# EAGLE design h-bridge2-smd-002 (EAGLE 7.2.0)
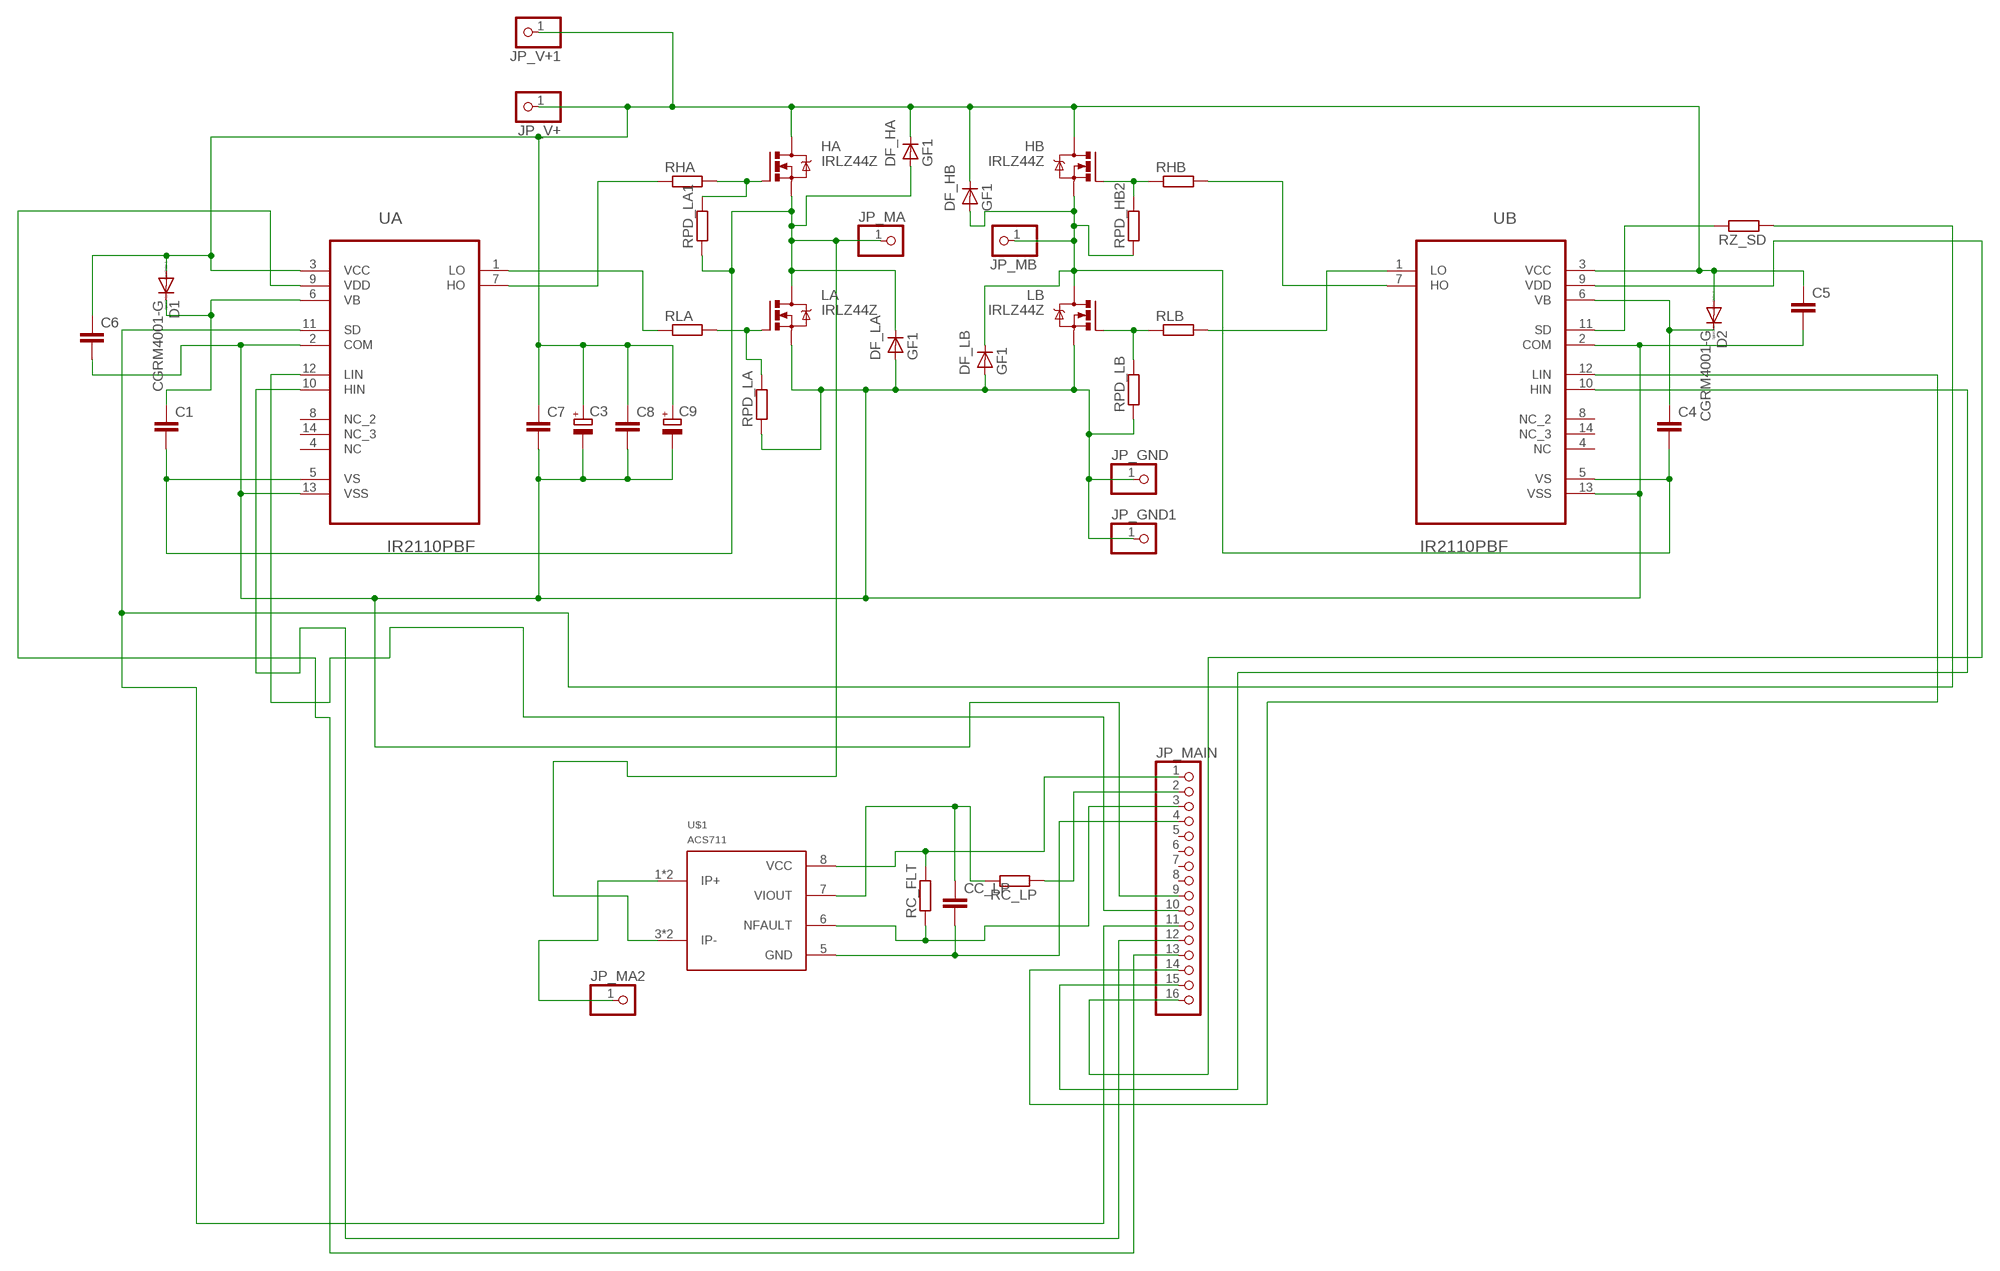
[diagram p0: schematic, sheet 1]

## Parts
C1  C-EUC4532  [C4532]
C3  CPOL-EUE5-13  [E5-13]
C4  C-EUC4532  [C4532]
C5  C-EUC4532  [C4532]
C6  C-EUC4532  [C4532]
C7  C-EUC4532  [C4532]
C8  C-EUC4532  [C4532]
C9  CPOL-EUE5-13  [E5-13]
CC_LP  C-EUC4532  [C4532]
D1  CGRM4001-G  [SOD-123_MINI-SMA]
D2  CGRM4001-G  [SOD-123_MINI-SMA]
DF_HA  GF1  [SMA-DO214AC]
DF_HB  GF1  [SMA-DO214AC]
DF_LA  GF1  [SMA-DO214AC]
DF_LB  GF1  [SMA-DO214AC]
HA  IRLZ44Z  [TO220BH]
HB  IRLZ44Z  [TO220BH]
JP_GND  PINHD-1X1  [1X01]
JP_GND1  PINHD-1X1  [1X01]
JP_MA  PINHD-1X1  [1X01]
JP_MA2  PINHD-1X1  [1X01]
JP_MAIN  PINHD-1X16  [1X16]
JP_MB  PINHD-1X1  [1X01]
JP_V+  PINHD-1X1  [1X01]
JP_V+1  PINHD-1X1  [1X01]
LA  IRLZ44Z  [TO220BH]
LB  IRLZ44Z  [TO220BH]
RC_FLT  R-EU_R1206  [R1206]
RC_LP  R-EU_R1206  [R1206]
RHA  R-EU_R1206  [R1206]
RHB  R-EU_R1206  [R1206]
RLA  R-EU_R1206  [R1206]
RLB  R-EU_R1206  [R1206]
RPD_HB2  R-EU_R1206  [R1206]
RPD_LA  R-EU_R1206  [R1206]
RPD_LA1  R-EU_R1206  [R1206]
RPD_LB  R-EU_R1206  [R1206]
RZ_SD  R-EU_R1206  [R1206]
U$1  ACS711  [SOIC8]
UA  IR2110PBF  [DIP254P762X533-14]
UB  IR2110PBF  [DIP254P762X533-14]

## Nets
N$1: JP_MA2.1 U$1.1(IP+) U$1.2(IP+)
N$2: JP_MAIN.1 RC_FLT.2 U$1.8(VCC)
N$3: JP_MAIN.3 RC_FLT.1 U$1.6(NFAULT)
N$4: C3.- C5.2 C6.2 C7.2 C8.2 C9.- DF_LA.A DF_LB.A JP_GND1.1 JP_GND.1 JP_MAIN.9 LA.S LB.S RPD_LA.1 RPD_LB.1 UA.2(COM) UA.13(VSS) UB.2(COM) UB.13(VSS)
N$5: LA.G RLA.2 RPD_LA.2
N$6: HA.G RHA.2 RPD_LA1.2
N$7: HB.G RHB.1 RPD_HB2.2
N$8: LB.G RLB.1 RPD_LB.2
N$9: RHA.1 UA.7(HO)
N$10: RLA.1 UA.1(LO)
N$11: RHB.2 UB.7(HO)
N$12: RLB.2 UB.1(LO)
N$13: C3.+ C5.1 C6.1 C7.1 C8.1 C9.+ D1.A D2.A DF_HA.K(C) DF_HB.K(C) HA.D HB.D JP_V+1.1 JP_V+.1 UA.3(VCC) UB.3(VCC)
N$14: C1.1 D1.C UA.6(VB)
N$15: CC_LP.1 RC_LP.2 U$1.7(VIOUT)
N$17: C1.2 DF_HA.A DF_LA.K(C) HA.S JP_MA.1 LA.D RPD_LA1.1 U$1.3(IP-) U$1.4(IP-) UA.5(VS)
N$18: C4.1 D2.C UB.6(VB)
N$19: JP_MAIN.2 RC_LP.1
N$20: JP_MAIN.11 RZ_SD.1 UA.11(SD)
N$21: CC_LP.2 JP_MAIN.4 U$1.5(GND)
N$22: JP_MAIN.13 UA.9(VDD)
N$23: JP_MAIN.12 UA.10(HIN)
N$24: JP_MAIN.10 UA.12(LIN)
N$25: JP_MAIN.16 UB.9(VDD)
N$26: JP_MAIN.15 UB.10(HIN)
N$27: JP_MAIN.14 UB.12(LIN)
N$28: RZ_SD.2 UB.11(SD)
N$29: C4.2 DF_HB.A DF_LB.K(C) HB.S JP_MB.1 LB.D RPD_HB2.1 UB.5(VS)
Unconnected: JP_MAIN.5 JP_MAIN.6 JP_MAIN.7 JP_MAIN.8 UA.4(NC) UA.8(NC_2) UA.14(NC_3) UB.4(NC) UB.8(NC_2) UB.14(NC_3)

## Library data of the parts
C1 C4-C8 CC_LP = rcl:C-EU: CAPACITOR, European symbol
C3 C9 = rcl:CPOL-EU: POLARIZED CAPACITOR, European symbol
D1 D2 = diode:CGRM400*-G: Molded plasitc,JEDEC SOD-123/Mini SMA Source: Comchip CGRM4001-G.pdf
DF_HA DF_HB DF_LA DF_LB = diode:GF1: DIODE
HA HB LA LB = transistor-power:IRLZ44Z: N-Channel HEXFET® Power MOSFET Logic Level AUTOMOTIVE MOSFET Source: http://www.irf.com/product-info/datasheets/data/irlz44zpbf.pdf
JP_GND JP_GND1 JP_MA JP_MA2 JP_MB JP_V+ JP_V+1 = dbg-misc:PINHD-1X1: PIN HEADER
JP_MAIN = pinhead:PINHD-1X16: PIN HEADER
RC_FLT RC_LP RHA RHB RLA RLB RPD_HB2 RPD_LA RPD_LA1 RPD_LB RZ_SD = rcl:R-EU_: RESISTOR, European symbol
U$1 = acs711:ACS711
UA UB = ir2110:IR2110PBF: HIGH AND LOW SIDE DRIVER; MPN: IR2110PBF; OC_FARNELL: 8638837; OC_NEWARK: 63J7859; PACKAGE: PDIP-14; SUPPLIER: INTERNATIONAL RECTIFIER

## Board
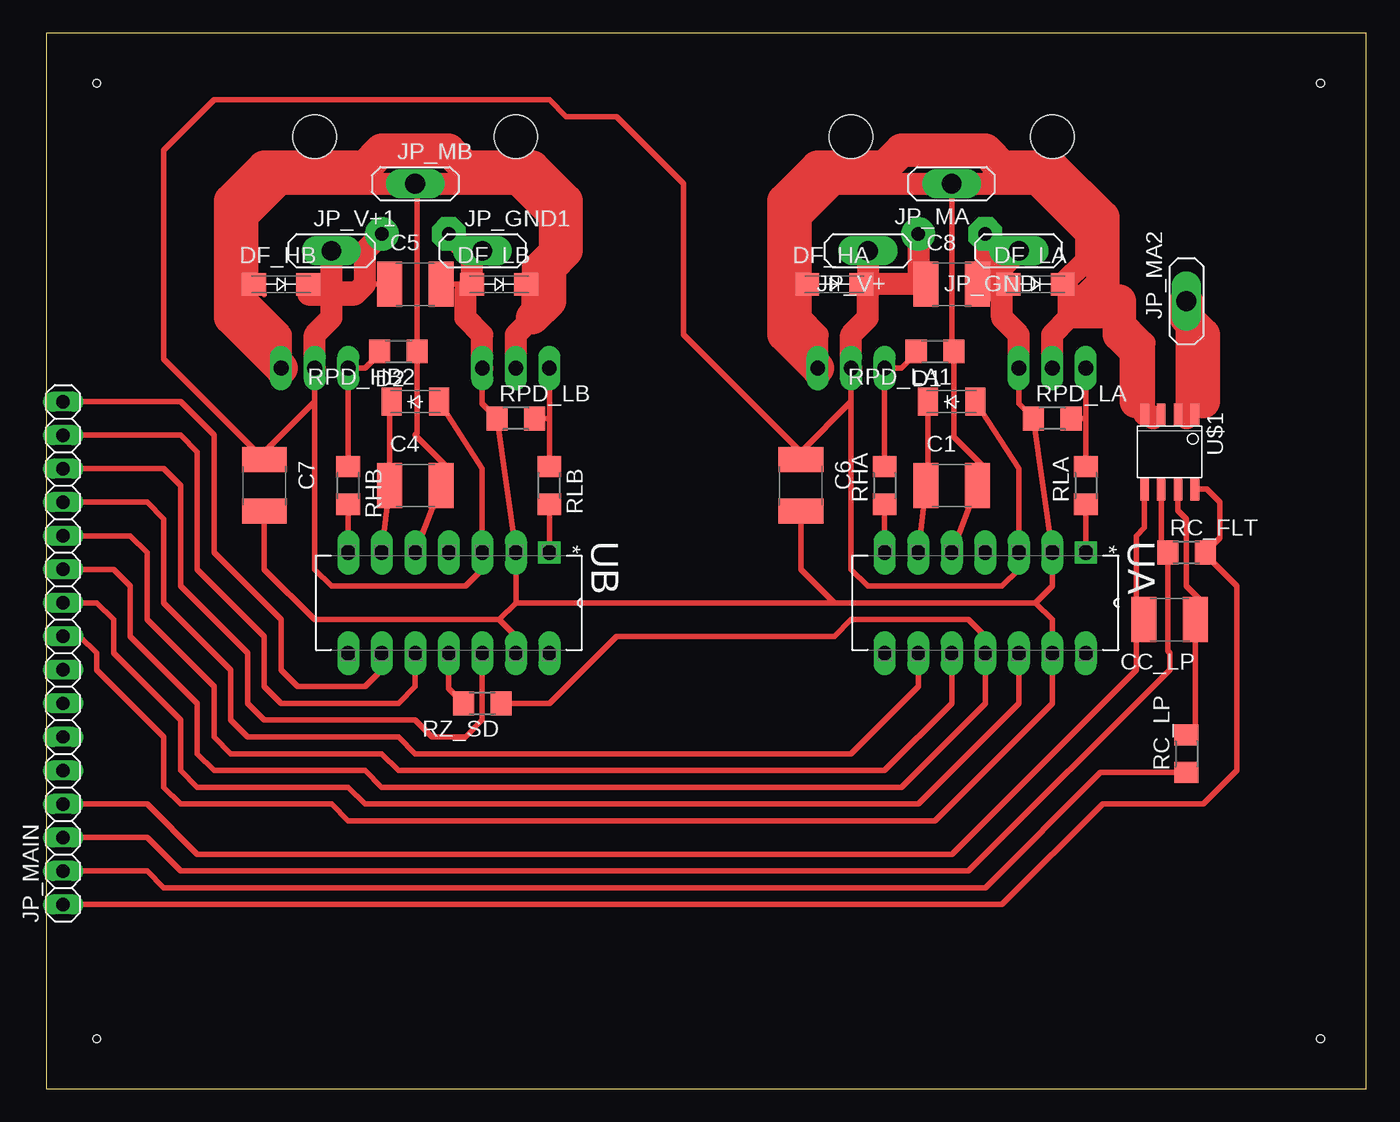
[diagram p1: board, top side]
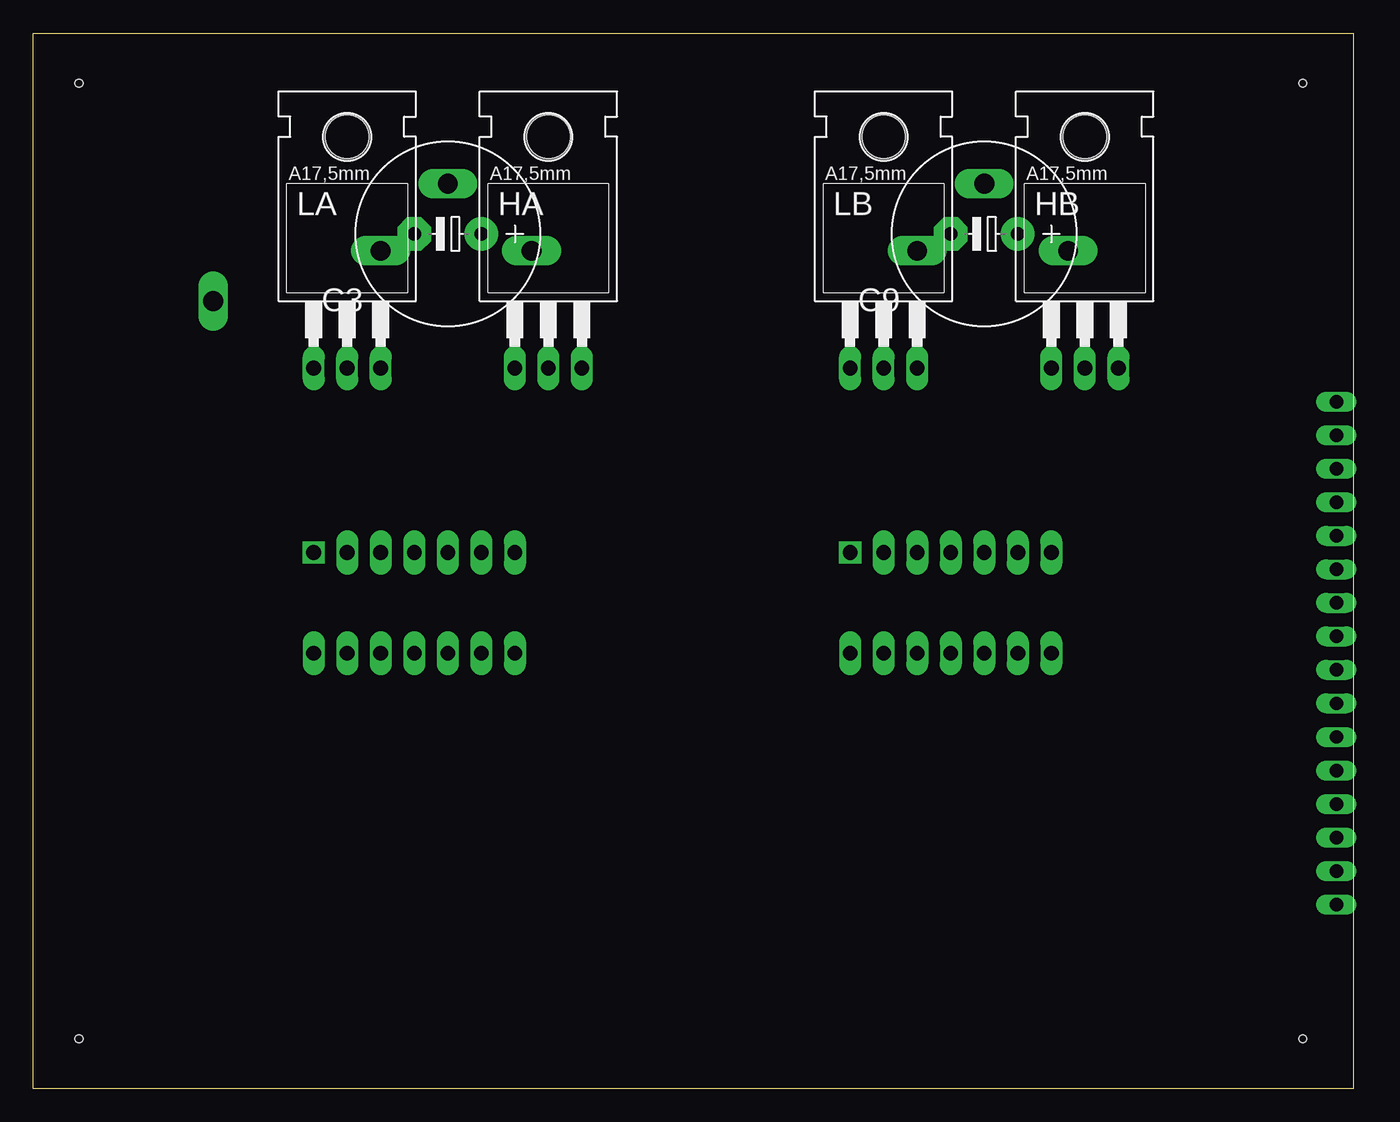
[diagram p2: board, bottom side, seen from below]

Size 100 x 80 mm. Coordinates in mm from the lower left corner, seen from the top.
Outline: 0,0 100,0 100,80 0,80 0,0
Copper layers (1*16): Top 0.035mm / dielectric 1.5mm / Bottom 0.035mm
Design rules "default": minimum track width 10mil, minimum drill 24mil, track to track 8mil, track to pad 8mil, pad to pad 8mil, via to via 8mil, smd to smd 8mil, copper to edge 40mil, drill to drill 8mil, minimum pad ring 10mil, minimum via ring 8mil, stop-mask expansion 4mil, vias tented up to drill 0mil, thermal gap 10mil
Holes 0.6 mm at 3.81,3.81 3.81,76.2 96.52,76.2 96.52,3.81

### Footprints (pad centres in the part's own frame; a part is rotated, then mirrored left to right if it is on the bottom)
C4532 = smd 1.9 x 3.4: 1 -1.95,0; 2 1.95,0
E5-13 = drill 1.016 pad 2.54: + -2.54,0 | drill 1.016 pad 2.54 octagon: - 2.54,0
SOD-123_MINI-SMA = smd 1.5 x 2.1: A 1.8,0; C -1.8,0
SMA-DO214AC = smd 1.8 x 1.7: A -2.05,0; K 2.05,0
TO220BH = drill 1.118 long: D 0,-6.35; G -2.54,-6.35; S 2.54,-6.35 | hole 3.302: 0,11.176
1X01 = drill 1.5 long: 1 0,0
1X16 = drill 1.016 long: 1 -19.05,0; 2 -16.51,0; 3 -13.97,0; 4 -11.43,0; 5 -8.89,0; 6 -6.35,0; 7 -3.81,0; 8 -1.27,0; 9 1.27,0; 10 3.81,0; 11 6.35,0; 12 8.89,0; 13 11.43,0; 14 13.97,0; 15 16.51,0; 16 19.05,0
R1206 = smd 1.6 x 1.803: 1 -1.422,0; 2 1.422,0
SOIC8 = smd 0.65 x 1.75: 1 -1.905,-2.8; 2 -0.635,-2.8; 3 0.635,-2.8; 4 1.905,-2.8; 5 1.905,2.8; 6 0.635,2.8; 7 -0.635,2.8; 8 -1.905,2.8
DIP254P762X533-14 = drill 1.118 square: 1 -7.62,15.24 | drill 1.118 long: 2 -7.62,12.7; 3 -7.62,10.16; 4 -7.62,7.62; 5 -7.62,5.08; 6 -7.62,2.54; 7 -7.62,0; 8 0,0; 9 0,2.54; 10 0,5.08; 11 0,7.62; 12 0,10.16; 13 0,12.7; 14 0,15.24

### Placement (x,y rotation side)
C1  68.58,45.72 0 top
C3  68.58,64.77 180 bottom
C4  27.94,45.72 0 top
C5  27.94,60.96 0 top
C6  57.15,45.72 270 top
C7  16.51,45.72 270 top
C8  68.58,60.96 0 top
C9  27.94,64.77 180 bottom
CC_LP  85.09,35.56 180 top
D1  68.58,52.07 0 top
D2  27.94,52.07 0 top
DF_HA  59.69,60.96 0 top
DF_HB  17.78,60.96 0 top
DF_LA  74.93,60.96 0 top
DF_LB  34.29,60.96 0 top
HA  60.96,60.96 0 bottom
HB  20.32,60.96 0 bottom
JP_GND  73.66,63.5 180 top
JP_GND1  33.02,63.5 0 top
JP_MA  68.58,68.58 180 top
JP_MA2  86.36,59.69 90 top
JP_MAIN  1.27,33.02 90 top
JP_MB  27.94,68.58 0 top
JP_V+  62.23,63.5 180 top
JP_V+1  21.59,63.5 0 top
LA  76.2,60.96 0 bottom
LB  35.56,60.96 0 bottom
RC_FLT  86.36,40.64 0 top
RC_LP  86.36,25.4 90 top
RHA  63.5,45.72 90 top
RHB  22.86,45.72 270 top
RLA  78.74,45.72 90 top
RLB  38.1,45.72 270 top
RPD_HB2  26.67,55.88 180 top
RPD_LA  76.2,50.8 0 top
RPD_LA1  67.31,55.88 180 top
RPD_LB  35.56,50.8 0 top
RZ_SD  33.02,29.21 180 top
U$1  85.09,48.26 180 top
UA  63.5,33.02 270 top
UB  22.86,33.02 270 top

### Tracks (layer width: path | path; a pad name or v marks a point on that pad's centre or on a via)
N$1
  Top 0.406: U$1.2 U$1.1 86.62,51.06 86.36,50.8
  Top 1.676: JP_MA2.1 86.36,50.8
  Top 2.54: JP_MA2.1 86.36,58.42 87.63,57.15 87.63,52.07
N$2
  Top 0.406: U$1.8 87.89,45.46 88.9,44.45 88.9,41.76 RC_FLT.2 87.78,40.49 90.17,38.1 90.17,24.13 87.63,21.59 80.01,21.59 72.39,13.97 67.31,13.97 66.04,13.97 JP_MAIN.1
N$3
  Top 0.406: U$1.6 84.45,41.12 RC_FLT.1 84.94,33.17 85.09,33.02 85.09,31.75 69.85,16.51 10.16,16.51 7.62,19.05 JP_MAIN.3
N$4
  Top 0.406: UA.13 76.2,34.29 | LA.S 73.66,51.92 RPD_LA.1 | 74.93,50.65 RPD_LA.1 | RPD_LA.1 UA.2 76.2,38.1 74.93,36.83 | LB.S 33.02,51.92 RPD_LB.1 UB.2 35.56,36.83 | C7.2 16.51,39.37 20.32,35.56 34.29,35.56 | 34.29,35.56 35.56,36.83 | 34.29,35.56 35.56,34.29 UB.13 | C5.2 DF_LB.A | 35.56,36.83 59.69,36.83 | 59.69,36.83 74.93,36.83 | JP_MAIN.9 2.54,34.29 3.81,33.02 3.81,31.75 8.89,26.67 8.89,22.86 10.16,21.59 21.59,21.59 22.86,20.32 67.31,20.32 76.2,29.21 UA.13 | 74.93,36.83 76.2,35.56 UA.13 | 59.69,36.83 57.15,39.37 C6.2 57.15,44.45
  Top 1.676: C3.- 71.12,61.55 C8.2 71.02,60.47 72.39,60.47 | LA.S 73.66,57.15 72.39,58.42 72.39,60.47 | 72.39,60.47 DF_LA.A 72.39,60.96 72.39,62.23 JP_GND.1 | LB.S 33.02,57.15 31.75,58.42 31.75,60.47 DF_LB.A 32.24,62.72 JP_GND1.1 31.75,63.5 C9.-
N$5
  Top 0.406: LA.G 78.74,50.8 | 78.74,50.8 RLA.2 | RPD_LA.2 78.74,50.8
N$6
  Top 0.406: RHA.2 HA.G 64.77,54.61 65.89,55.73 RPD_LA1.2
N$7
  Top 0.406: RHB.1 HB.G 24.13,54.61 25.25,55.73 RPD_HB2.2
N$8
  Top 0.406: LB.G 38.1,50.8 | 38.1,50.8 RLB.1 | RPD_LB.2 38.1,50.8
N$9
  Top 0.406: RHA.1 UA.7
N$10
  Top 0.406: UA.1 RLA.1
N$11
  Top 0.406: UB.7 RHB.2
N$12
  Top 0.406: UB.1 RLB.2
N$13
  Top 0.406: HA.D 60.96,52.07 | 60.96,52.07 60.96,39.37 62.23,38.1 72.39,38.1 73.66,39.37 UA.3 73.66,46.99 D1.A 69.85,52.07 | 57.15,48.26 60.96,52.07 | D2.A 33.02,46.99 UB.3 33.02,39.37 31.75,38.1 21.59,38.1 20.32,39.37 20.32,52.07 | 20.32,52.07 HB.D | 20.32,52.07 16.51,48.26 C7.1 8.89,55.29 8.89,71.12 12.7,74.93 38.1,74.93 39.37,73.66 43.18,73.66 48.26,68.58 48.26,57.15 57.15,48.26 | 19.83,60.18 DF_HB.K 24.13,60.96 C5.1 | C6.1 57.15,48.26
  Top 1.016: 66.14,60.47 C8.1
  Top 1.676: HA.D 60.96,57.15 62.23,58.42 62.23,60.47 | 62.23,60.47 DF_HA.K | C8.1 66.04,60.96 | 66.04,60.96 62.72,60.96 | 62.72,60.96 62.23,60.47 | C3.+ 66.04,60.96 | JP_V+.1 62.23,61.45 62.72,60.96 | HB.D 20.32,57.15 21.59,58.42 21.59,60.18 | 21.59,60.18 JP_V+1.1 | 19.83,60.18 21.59,60.18 | 21.59,60.18 23.35,60.18 24.13,60.96 24.13,63.5 C9.+
N$14
  Top 0.406: 67.31,44.45 67.31,45.04 C1.1 | D1.C 66.78,45.87 C1.1 | UA.6 C1.1
N$15
  Top 0.406: U$1.7 85.72,43.81 86.36,43.18 86.36,38.1 87.63,36.83 87.63,36.15 CC_LP.1 87.04,27.5 RC_LP.2
N$17
  Top 0.406: JP_MA.1 68.58,56.03 RPD_LA1.1 68.73,49.38 71.12,46.99 71.12,46.31 C1.2 UA.5 | 83.82,50.8 84.19,50.8 U$1.3 | 71.12,71.12 71.12,68.58
  Top 1.676: HA.S 58.42,57.15 57.15,58.42 57.15,60.47 | 57.15,60.47 DF_HA.A | LA.D 76.2,57.15 77.47,58.42 | 77.47,58.42 77.47,60.47 DF_LA.K 78.74,62.72 78.74,64.77 74.93,68.58 71.12,68.58 JP_MA.1 59.69,68.58 57.15,66.04 57.15,60.47 | 77.47,58.42 81.28,58.42 83.19,56.52 U$1.4 83.56,51.06 83.82,50.8
  Top 2.54: HA.S 55.88,57.15 55.88,67.31 58.42,69.85 63.5,69.85 64.77,71.12 71.12,71.12 72.39,69.85 76.2,69.85 80.01,66.04 80.01,60.96 78.74,59.69 81.28,59.69 81.28,57.15 82.55,55.88 82.55,52.07
N$18
  Top 0.406: UB.6 C4.1 25.99,51.92 D2.C
N$19
  Top 0.406: RC_LP.1 79.86,23.98 71.12,15.24 8.89,15.24 7.62,16.51 JP_MAIN.2
N$20
  Top 0.406: JP_MAIN.11 5.08,39.37 6.35,38.1 6.35,34.29 11.43,29.21 11.43,25.4 12.7,24.13 24.13,24.13 25.4,22.86 64.77,22.86 71.12,29.21 UA.11 71.12,34.29 69.85,35.56 60.96,35.56 59.69,34.29 43.18,34.29 38.1,29.21 RZ_SD.1
N$21
  Top 0.406: U$1.5 83.19,42.55 82.55,41.91 82.55,36.15 | 82.55,36.15 CC_LP.2 | 82.55,36.15 82.55,31.75 68.58,17.78 11.43,17.78 7.62,21.59 JP_MAIN.4
N$22
  Top 0.406: JP_MAIN.13 7.62,44.45 8.89,43.18 8.89,36.83 13.97,31.75 13.97,27.94 15.24,26.67 26.67,26.67 27.94,25.4 60.96,25.4 66.04,30.48 UA.9
N$23
  Top 0.406: JP_MAIN.12 6.35,41.91 7.62,40.64 7.62,35.56 12.7,30.48 12.7,26.67 13.97,25.4 25.4,25.4 26.67,24.13 63.5,24.13 68.58,29.21 UA.10
N$24
  Top 0.406: JP_MAIN.10 3.81,36.83 5.08,35.56 5.08,33.02 10.16,27.94 10.16,24.13 11.43,22.86 22.86,22.86 24.13,21.59 66.04,21.59 73.66,29.21 UA.12
N$25
  Top 0.406: JP_MAIN.16 10.16,52.07 12.7,49.53 12.7,40.64 17.78,35.56 17.78,31.75 19.05,30.48 24.13,30.48 25.4,31.75 UB.9
N$26
  Top 0.406: UB.10 27.94,30.48 26.67,29.21 17.78,29.21 16.51,30.48 16.51,34.29 11.43,39.37 11.43,48.26 10.16,49.53 JP_MAIN.15
N$27
  Top 0.406: JP_MAIN.14 8.89,46.99 10.16,45.72 10.16,38.1 15.24,33.02 15.24,29.21 16.51,27.94 27.94,27.94 29.21,26.67 31.75,26.67 33.02,27.94 UB.12
N$28
  Top 0.406: UB.11 30.48,30.33 RZ_SD.2
N$29
  Top 0.406: UB.5 C4.2 30.48,46.31 30.48,46.99 27.94,49.53 28.09,49.68 RPD_HB2.1 28.09,68.43 JP_MB.1 | 16.51,60.18 DF_HB.A 13.97,60.96 15.24,59.69
  Top 1.676: HB.S 17.78,57.15 15.24,59.69 15.24,66.04 17.78,68.58 JP_MB.1 35.56,68.58 38.1,66.04 38.1,63.5 36.83,62.23 36.83,61.45 DF_LB.K 36.83,60.47 36.83,58.42 35.56,57.15 LB.D
  Top 2.54: 36.83,58.42 38.1,59.69 38.1,62.23 39.37,63.5 39.37,67.31 36.83,69.85 31.75,69.85 30.48,71.12 25.4,71.12 24.13,69.85 16.51,69.85 13.97,67.31 13.97,60.96 13.97,58.42 HB.S